# Altium schematic sheet 8.3 LV_SIGNAL&FILTER.SchDoc: 6.6kW Daul OBC +11kW WPT
size A3; Revision: V 1.0; SheetNumber: 11; SheetTotal: 14; ImagePath: 0
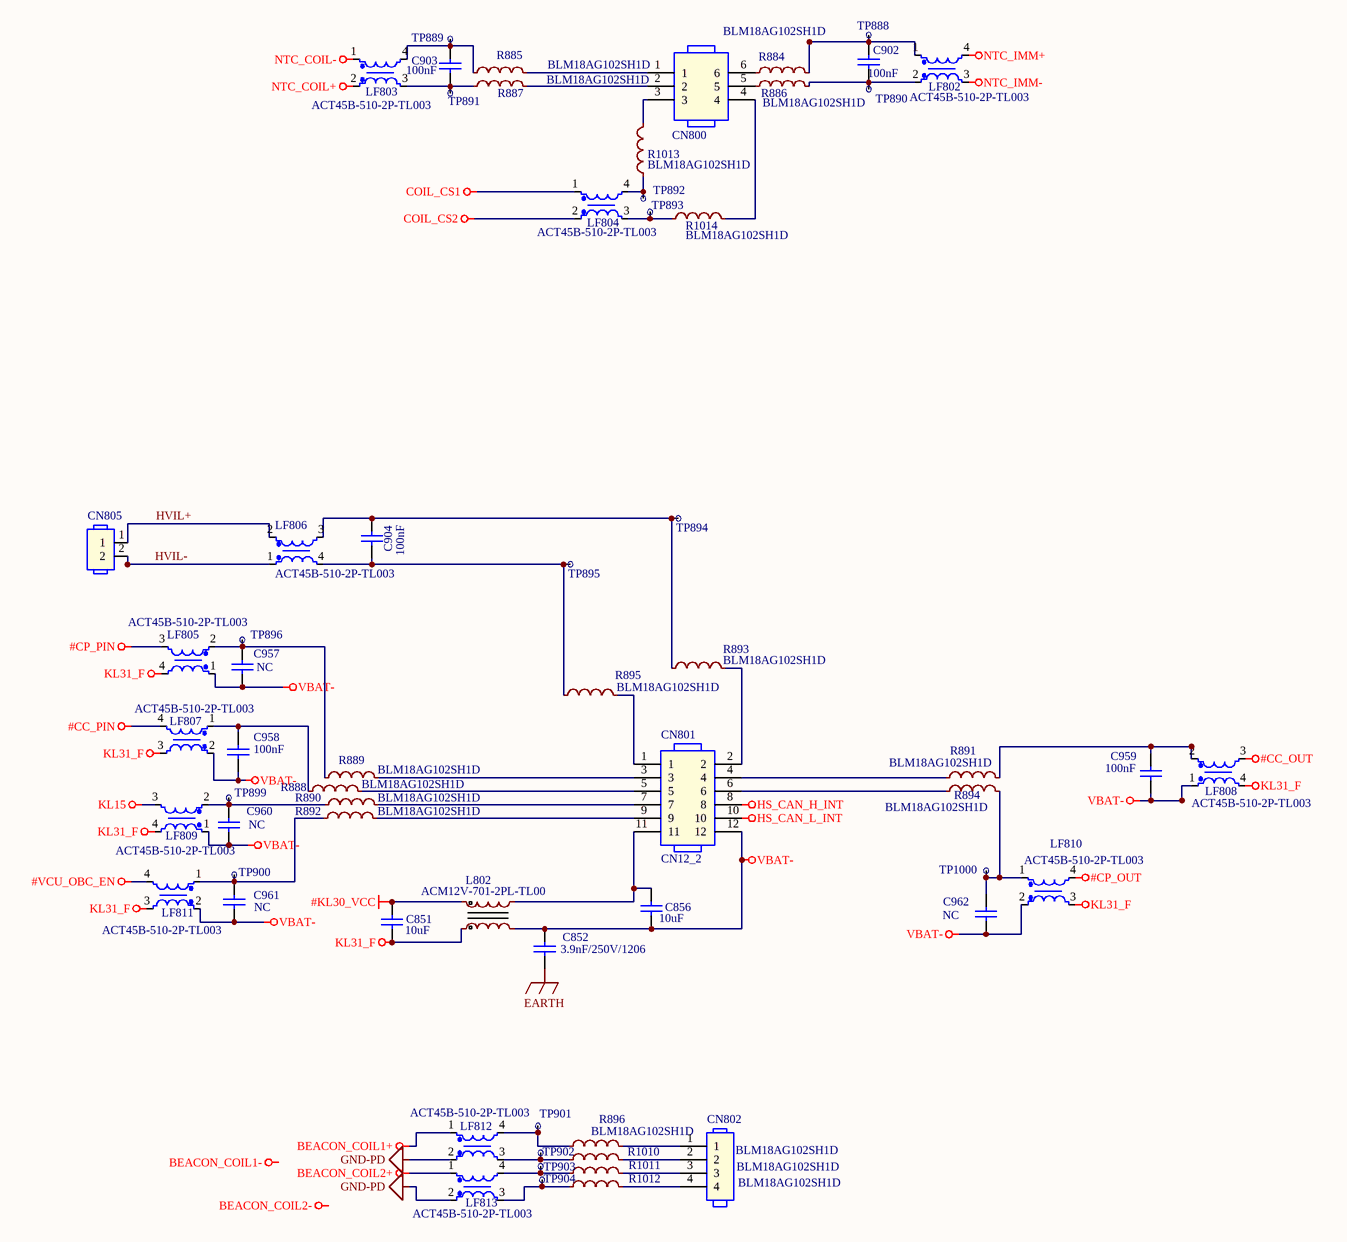
[diagram p0: 8.3 LV_SIGNAL&FILTER.SchDoc]

## Parts
C851  值: 10uF  [C1206]  (hidden comment: 10uF 50V ±10% X5R 1206)
C852  3.9nF/250V/1206  [C1206]
C856  值: 10uF  [C1206]  (hidden comment: 10uF 50V ±10% X5R 1206)
C902  值: 100nF  [C0603]  (hidden comment: 100nF 50V ±10% X7R 0603)
C903  值: 100nF  [C0603]  (hidden comment: 100nF 50V ±10% X7R 0603)
C904  值: 100nF  [C0603]  (hidden comment: 100nF 50V ±10% X7R 0603)
C957  NC  [C0603]
C958  值: 100nF  [C0603]  (hidden comment: 100nF 50V ±10% X7R 0603)
C959  值: 100nF  [C0603]  (hidden comment: 100nF 50V ±10% X7R 0603)
C960  NC  [C0603]
C961  NC  [C0603]
C962  NC  [C0603]
CN800  (no value)  [CN6-PIN2]
CN801  CN12_2  [J_P2MM_2*6]
CN802  (no value)  [HY_2MM_1*4P_90MOLEX01]
CN805  (no value)  [HY_2MM_1*2P_90MOLEX01]
L802  ACM12V-701-2PL-TL00  [ACM12V-701-2PL-TL00]
LF802  ACT45B-510-2P-TL003  [L_4.5*3.2*2.8]
LF803  ACT45B-510-2P-TL003  [L_4.5*3.2*2.8]
LF804  ACT45B-510-2P-TL003  [L_4.5*3.2*2.8]
LF805  ACT45B-510-2P-TL003  [L_4.5*3.2*2.8]
LF806  ACT45B-510-2P-TL003  [L_4.5*3.2*2.8]
LF807  ACT45B-510-2P-TL003  [L_4.5*3.2*2.8]
LF808  ACT45B-510-2P-TL003  [L_4.5*3.2*2.8]
LF809  ACT45B-510-2P-TL003  [L_4.5*3.2*2.8]
LF810  ACT45B-510-2P-TL003  [L_4.5*3.2*2.8]
LF811  ACT45B-510-2P-TL003  [L_4.5*3.2*2.8]
LF812  ACT45B-510-2P-TL003  [L_4.5*3.2*2.8]
LF813  ACT45B-510-2P-TL003  [L_4.5*3.2*2.8]
R884  BLM18AG102SH1D  [R0603]
R885  BLM18AG102SH1D  [R0603]
R886  BLM18AG102SH1D  [R0603]
R887  BLM18AG102SH1D  [R0603]
R888  BLM18AG102SH1D  [R0603]
R889  BLM18AG102SH1D  [R0603]
R890  BLM18AG102SH1D  [R0603]
R891  BLM18AG102SH1D  [R0603]
R892  BLM18AG102SH1D  [R0603]
R893  BLM18AG102SH1D  [R0603]
R894  BLM18AG102SH1D  [R0603]
R895  BLM18AG102SH1D  [R0603]
R896  BLM18AG102SH1D  [R0603]
R1010  BLM18AG102SH1D  [R0603]
R1011  BLM18AG102SH1D  [R0603]
R1012  BLM18AG102SH1D  [R0603]
R1013  BLM18AG102SH1D  [R0603]
R1014  BLM18AG102SH1D  [R0603]
TP888  测试点  [测试点]  (value not drawn)
TP889  测试点  [测试点]  (value not drawn)
TP890  测试点  [测试点]  (value not drawn)
TP891  测试点  [测试点]  (value not drawn)
TP892  测试点  [测试点]  (value not drawn)
TP893  测试点  [测试点]  (value not drawn)
TP894  测试点  [测试点]  (value not drawn)
TP895  测试点  [测试点]  (value not drawn)
TP896  测试点  [测试点]  (value not drawn)
TP899  测试点  [测试点]  (value not drawn)
TP900  测试点  [测试点]  (value not drawn)
TP901  测试点  [测试点]  (value not drawn)
TP902  测试点  [测试点]  (value not drawn)
TP903  测试点  [测试点]  (value not drawn)
TP904  测试点  [测试点]  (value not drawn)
TP1000  测试点  [测试点]  (value not drawn)

## Nets
#CC_OUT: LF808.3
#CC_PIN: LF807.4
#CP_OUT: LF810.4
#CP_PIN: LF805.3
#KL30_VCC: C851.1 L802.1
#VCU_OBC_EN: LF811.4
BEACON_COIL1+: LF812.1
BEACON_COIL2+: LF813.1
COIL_CS1: LF804.1
COIL_CS2: LF804.2
EARTH: C852.1
GND-PD: LF812.2 LF813.2
HS_CAN_H_INT: CN801.8
HS_CAN_L_INT: CN801.10
KL15: LF809.3
KL31_F: C851.2 L802.2 LF805.4 LF807.3 LF808.4 LF809.4 LF810.3 LF811.3
NTC_COIL+: LF803.2
NTC_COIL-: LF803.1
NTC_IMM+: LF802.4
NTC_IMM-: LF802.3
VBAT-: C852.2 C856.2 C957.2 C958.2 C959.2 C960.2 C961.2 C962.2 CN801.12 L802.3 LF805.1 LF807.2 LF808.1 LF809.1 LF810.2 LF811.2
HVIL+: CN805.1 LF806.2
HVIL-: CN805.2 LF806.1
NetC856_1: C856.1 CN801.11 L802.4
NetC902_1: C902.1 LF802.1 R884.2 TP888.1
NetC902_2: C902.2 LF802.2 R886.2 TP890.1
NetC903_1: C903.1 LF803.4 R885.1 TP889.1
NetC903_2: C903.2 LF803.3 R887.1 TP891.1
NetC904_1: C904.1 LF806.3 R893.1 TP894.1
NetC904_2: C904.2 LF806.4 R895.1 TP895.1
NetC957_1: C957.1 LF805.2 R889.1 TP896.1
NetC958_1: C958.1 LF807.1 R888.1
NetC959_1: C959.1 LF808.2 R891.2
NetC960_1: C960.1 LF809.2 R890.1 TP899.1
NetC961_1: C961.1 LF811.1 R892.1 TP900.1
NetC962_1: C962.1 LF810.1 R894.2 TP1000.1
NetCN800_1: CN800.1 R885.2
NetCN800_2: CN800.2 R887.2
NetCN800_3: CN800.3 R1013.2
NetCN800_4: CN800.4 R1014.2
NetCN800_5: CN800.5 R886.1
NetCN800_6: CN800.6 R884.1
NetCN801_1: CN801.1 R895.2
NetCN801_2: CN801.2 R893.2
NetCN801_3: CN801.3 R889.2
NetCN801_4: CN801.4 R891.1
NetCN801_5: CN801.5 R888.2
NetCN801_6: CN801.6 R894.1
NetCN801_7: CN801.7 R890.2
NetCN801_9: CN801.9 R892.2
NetCN802_1: CN802.1 R896.2
NetCN802_2: CN802.2 R1010.2
NetCN802_3: CN802.3 R1011.2
NetCN802_4: CN802.4 R1012.2
NetLF804_3: LF804.3 R1014.1 TP893.1
NetLF804_4: LF804.4 R1013.1 TP892.1
NetLF812_3: LF812.3 R1010.1 TP902.1
NetLF812_4: LF812.4 R896.1 TP901.1
NetLF813_3: LF813.3 R1012.1 TP904.1
NetLF813_4: LF813.4 R1011.1 TP903.1

## Notes on the sheet
- Labels drawn without touching a wire or pin: BEACON_COIL1-, BEACON_COIL2-
- Revision:
- Title:
- Engineer:
- ModifiedDate
- ApprovedBy:
- Author:
- Size:
- A3
- DocumentName:
- Sheet
- of

## Library data of the parts
C851 C856 = 10uF 50V ±10% X5R 1206: 温度范围: -55℃~﹢125℃; 料号: 90-E00C0079; 重量: 16.2mg; 品名: CAP CER 10uF 50V ±10% X5R 1206, MURATA#GRT31CR61H106KE01; 厂商: MURATA; 规格: GRT31CR61H106KE01(MURATA); 耐压值: 50V
C852 = 10uF 50V ±10% X5R 1206: 温度范围: -55℃~﹢125℃; 料号: 90-E00C0079; 重量: 16.2mg; 品名: CAP CER 10uF 50V ±10% X5R 1206, MURATA#GRT31CR61H106KE01; 厂商: MURATA; 规格: GRT31CR61H106KE01(MURATA); 耐压值: 50V; 值: 3.9nF/250V/1206
C902-C904 C958 C959 = 100nF 50V ±10% X7R 0603: 温度范围: -55℃~﹢125℃; 料号: 90-E00C0002; 重量: 2mg; 品名: CAP CER 100nF 50V ±10% X7R 0603, TAIYO YUDEN#UMK107B7104KAHT; 厂商: TAIYO YUDEN; 规格: UMK107B7104KAHT(TAIYO YUDEN); Qualified: AEC-Q200; 耐压值: 50V
C957 C960-C962 = 100nF 50V ±10% X7R 0603: 温度范围: -55℃~﹢125℃; 料号: 90-E00C0002; 重量: 2mg; 品名: CAP CER 100nF 50V ±10% X7R 0603, TAIYO YUDEN#UMK107B7104KAHT; 厂商: TAIYO YUDEN; 规格: UMK107B7104KAHT(TAIYO YUDEN); 耐压值: 50V; Qualified: AEC-Q200; 值: NC
CN800 = CN2*3
CN801 = CN12_2: DIP/SMD: DIP
CN802 = CN1.25-04P
CN805 = CN1.25-02P
L802 = ACM4520F-301T30: BOM_Manufacturer: Meled(美莱); Contributor: LCSC; BOM_Supplier: LCSC; BOM_Supplier Part: C908555; BOM_Manufacturer Part: ACM4520F-301T30; BOM_JLCPCB Part Class: Extended Part; spicePre: L; spiceSymbolName: ACM4520F-301T30
LF802-LF813 = LINE FILTER_RING CORE: 51uH +50%-30% 0.2A SMD TDK; Top/Bottom: Top; VALUE: ACT45B-510-2P-TL003; DIP/SMD: SMD; Part Number: *
R884-R896 R1010-R1014 = BLM18AG102SH1D: BOM_Manufacturer: muRata(村田); Contributor: LCSC; BOM_Supplier: LCSC; BOM_Supplier Part: C337877; BOM_Manufacturer Part: BLM18AG102SH1D; BOM_JLCPCB Part Class: Extended Part; spicePre: U; spiceSymbolName: BLM18AG102SH1D